# Altium schematic sheet Arm_control_pull.SchDoc
size A4
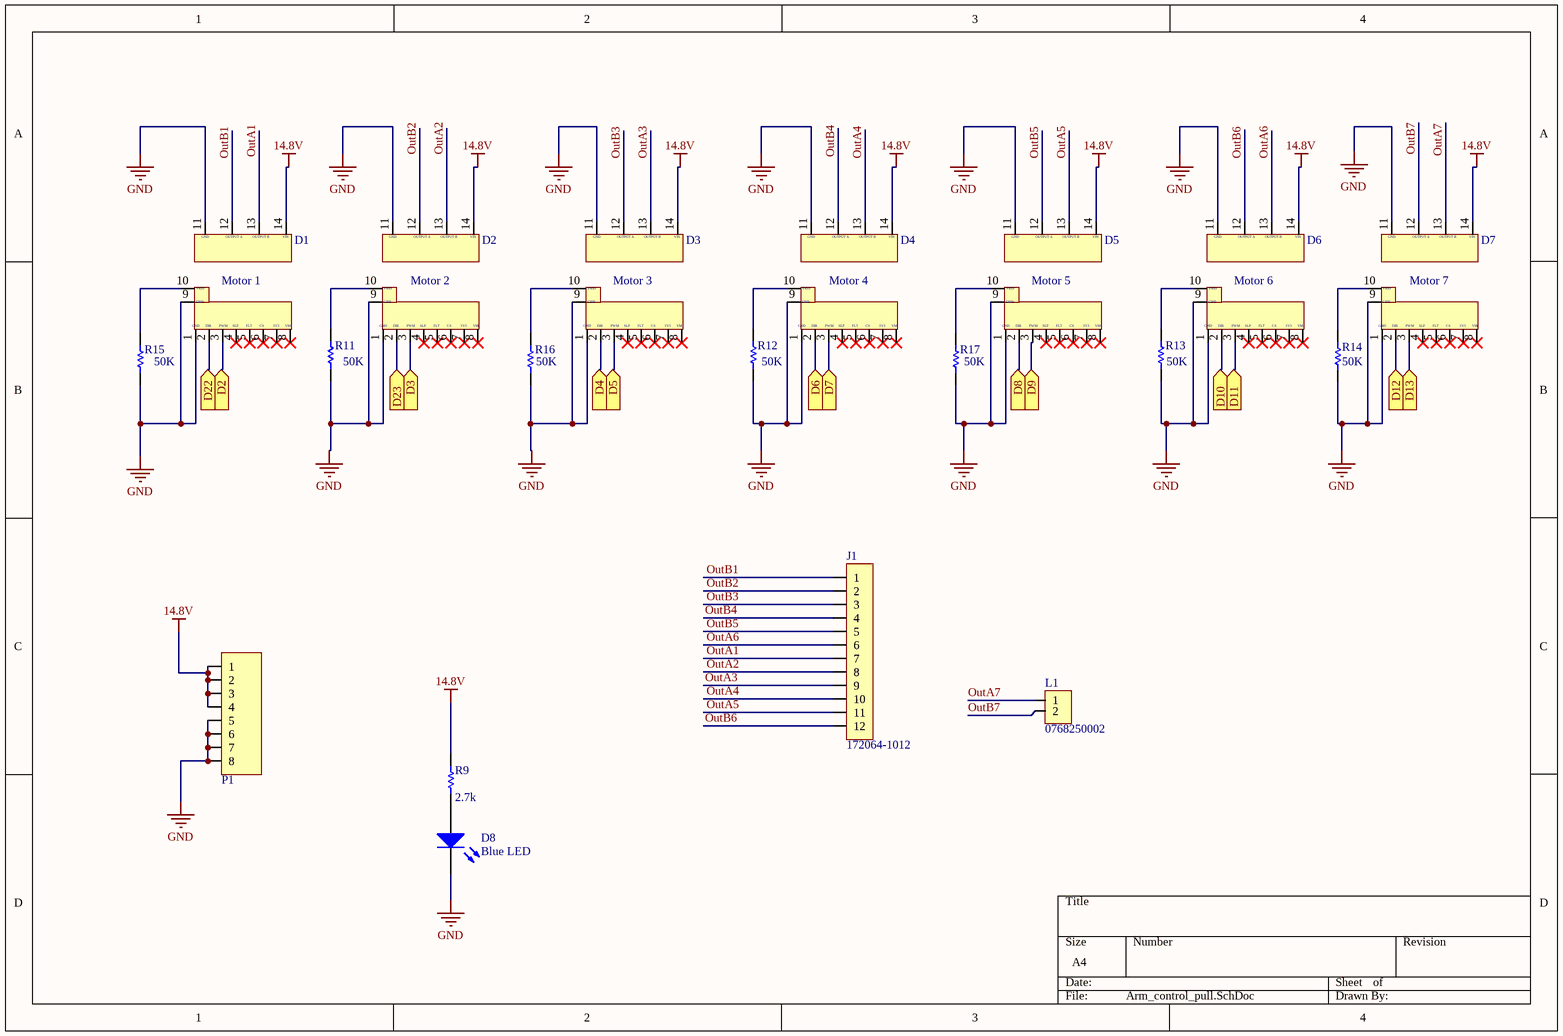
[diagram p0: Arm_control_pull.SchDoc]

## Parts
D1  Pololu G2 High-Power Motor Driver 18v25  [POLOLU 18V25]  (value not drawn)
D2  Pololu G2 High-Power Motor Driver 18v25  [POLOLU 18V25]  (value not drawn)
D3  Pololu G2 High-Power Motor Driver 18v25  [POLOLU 18V25]  (value not drawn)
D4  Pololu G2 High-Power Motor Driver 18v25  [POLOLU 18V25]  (value not drawn)
D5  Pololu G2 High-Power Motor Driver 18v25  [POLOLU 18V25]  (value not drawn)
D6  Pololu G2 High-Power Motor Driver 18v25  [POLOLU 18V25]  (value not drawn)
D7  Pololu G2 High-Power Motor Driver 18v25  [POLOLU 18V25]  (value not drawn)
D8  Blue LED  [LTST-C171TBKT]
J1  172064-1012  [172064-1012]
L1  0768250002  [MOLEX 0768250002]
P1  Mini-Fit Jr 8 Pos RA  [MOLEX 172065-0208]  (value not drawn)
R9  value 2.7k  [RESC1608X06N_0603]  (hidden comment: Res1)
R11  value 50K  [RESC1608X06N_0603]  (hidden comment: Res1)
R12  value 50K  [RESC1608X06N_0603]  (hidden comment: Res1)
R13  value 50K  [RESC1608X06N_0603]  (hidden comment: Res1)
R14  value 50K  [RESC1608X06N_0603]  (hidden comment: Res1)
R15  value 50K  [RESC1608X06N_0603]  (hidden comment: Res1)
R16  value 50K  [RESC1608X06N_0603]  (hidden comment: Res1)
R17  value 50K  [RESC1608X06N_0603]  (hidden comment: Res1)

## Ports
D2 (in), D3 (in), D4 (in), D5 (in), D6 (in), D7 (in), D8 (in), D9 (in), D10 (in), D11 (in), D12 (in), D13 (in), D22 (in), D23 (in)

## Nets
14.8V: D1.14 D2.14 D3.14 D4.14 D5.14 D6.14 D7.14 P1.1 P1.2 P1.3 P1.4 R9.1
GND: D1.1 D1.9 D1.11 D2.1 D2.9 D2.11 D3.1 D3.9 D3.11 D4.1 D4.9 D4.11 D5.1 D5.9 D5.11 D6.1 D6.9 D6.11 D7.1 D7.9 D7.11 D8.2(K) P1.5 P1.6 P1.7 P1.8 R11.1 R12.1 R13.1 R14.1 R15.1 R16.1 R17.1
D2: D1.3 ; port D2
D3: D2.3 ; port D3
D4: D3.2 ; port D4
D5: D3.3 ; port D5
D6: D4.2 ; port D6
D7: D4.3 ; port D7
D8: D5.2 ; port D8
D9: D5.3 ; port D9
D10: D6.2 ; port D10
D11: D6.3 ; port D11
D12: D7.2 ; port D12
D13: D7.3 ; port D13
D22: D1.2 ; port D22
D23: D2.2 ; port D23
OutA1: D1.13 J1.7
OutA2: D2.13 J1.8
OutA3: D3.13 J1.9
OutA4: D4.13 J1.10
OutA5: D5.13 J1.11
OutA6: D6.13 J1.6
OutA7: D7.13 L1.1
OutB1: D1.12 J1.1
OutB2: D2.12 J1.2
OutB3: D3.12 J1.3
OutB4: D4.12 J1.4
OutB5: D5.12 J1.5
OutB6: D6.12 J1.12
OutB7: D7.12 L1.2
NetD1_10: D1.10 R15.2
NetD2_10: D2.10 R11.2
NetD3_10: D3.10 R16.2
NetD4_10: D4.10 R12.2
NetD5_10: D5.10 R17.2
NetD6_10: D6.10 R13.2
NetD7_10: D7.10 R14.2
NetD8_1: D8.1(A) R9.2

Not connected (* = marked no-connect by the designer): D1 4* 5* 6* 7* 8*; D2 4* 5* 6* 7* 8*; D3 4* 5* 6* 7* 8*; D4 4* 5* 6* 7* 8*; D5 4* 5* 6* 7* 8*; D6 4* 5* 6* 7* 8*; D7 4* 5* 6* 7* 8*

## Notes on the sheet
- (near D1) Motor 1
- (near D2) Motor 2
- (near D3) Motor 3
- (near D4) Motor 4
- (near D5) Motor 5
- (near D6) Motor 6
- (near D7) Motor 7
- (in symbol Pololu G2 High-Power Motor Driver 18v25) GND; OUTPUT A; OUTPUT B; VIN; VREF; DIR; PWM; SLP; FLT; CS; 3V3; VM

## Library data of the parts
J1 = 172064-1012: Conn Shrouded Header HDR 12 POS 5.7mm Solder RA Thru-Hole Tray; Manufacturer 1: Molex Waldom; Number of Positions: 12; Connector Type: Male Pin; Row Spacing: 0.224inch; Glow Wire Compliant: Compliant; Supplier 1: Digi-Key; Supplier Part Number 1: WM11214-ND; Manufacturer Part Number 1: 172064-1012; Stock 1: 343; Pricing 1: 1=16.34000, 10=14.85400, 100=12.62590, 500=10.76916, 1000=9.87791 (USD); RoHS: Yes; Mount: Through Hole; Contact Plating: Gold; Color: Black; Min Operating Temperature: -40°C; Max Operating Temperature: 120°C; Packaging: Tray; Number of Rows: 2; Termination: Solder; Fastening Type: Ramp; Number of Contacts: 12; Orientation: Right Angle; Number of Circuits: 12; Pitch: 5.7mm; Halogen Free: Low Halogen; ComponentLink1URL: http://www.molex.com/pdm_docs/ps/PS-76823-100.pdf?src-supplier=Digi-Key; ComponentLink1Description: http://www.molex.com/pdm_docs/ps/PS-76823-100.pdf?src-supplier=Digi-Key; ComponentLink2URL: http://www.molex.com/pdm_docs/sd/1720641004_sd.pdf?src-supplier=Avnet; ComponentLink2Description: http://www.molex.com/pdm_docs/sd/1720641004_sd.pdf?src-supplier=Avnet; Category: Connectors
L1 = 0768250002: Conn Power HDR 2 POS 5.7mm Solder RA Thru-Hole 2 Terminal 1 Port; Manufacturer 1: Molex; Color: Black; Number of Positions: 2; Connector Type: Male Pin; Row Spacing: 0.224inch; Supplier 1: Digi-Key; Supplier Part Number 1: WM11969-ND; Manufacturer Part Number 1: 0768250002; Stock 1: 2157; Pricing 1: 1=1.13000, 10=0.99300, 25=0.93440, 50=0.89560, 100=0.85670, 250=0.77880, 500=0.70092, 2016=0.58410, 4032=0.56463 (USD); RoHS: Yes; Mount: Through Hole; Contact Plating: Tin; Number of Rows: 2; Termination: Solder; Packaging: Tray; Fastening Type: Ramp; ComponentLink1URL: https://www.molex.com/pdm_docs/sd/768250002_sd.pdf?src-supplier=Digi-Key; ComponentLink1Description: https://www.molex.com/pdm_docs/sd/768250002_sd.pdf?src-supplier=Digi-Key; Category: Connectors
P1 = Molex Mega-Fit 8pos Vert
R9 R11-R17 = Res1: Resistor; Published: 8-Jun-2000; LatestRevisionDate: 17-Jul-2002; LatestRevisionNote: Re-released for DXP Platform.; PackageReference: AXIAL-0.3; Publisher: Altium Limited; PackageDescription: Axial Device, Thru-Hole; 2 Leads; 0.3 in Pin Spacing
D1-D7 = Pololu G2 High-Power Motor Driver 18v25: Category: Brushed DC motor